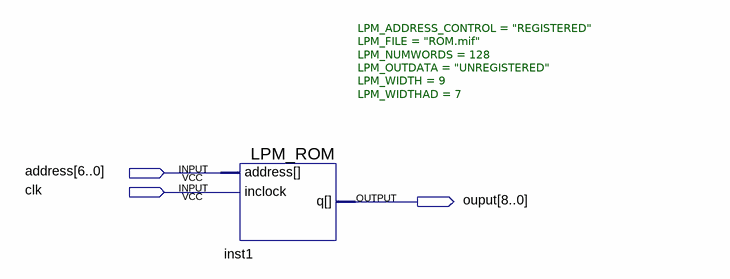
[diagram p0: schematic sheet]
// Quartus schematic ROM_test.bdf as structural Verilog: 1 symbols, 3 pins
module ROM_test (
  input  [6:0] address,
  input  clk,
  output [8:0] ouput
);

  LPM_ROM #(.LPM_ADDRESS_CONTROL("REGISTERED"), .LPM_FILE("ROM.mif"), .LPM_NUMWORDS(128), .LPM_OUTDATA("UNREGISTERED"), .LPM_WIDTH(9), .LPM_WIDTHAD(7)) inst1 (
    .address(address), .inclock(clk), .q(ouput));
endmodule
